# EAGLE design Breadboard_latest (EAGLE 6.4)
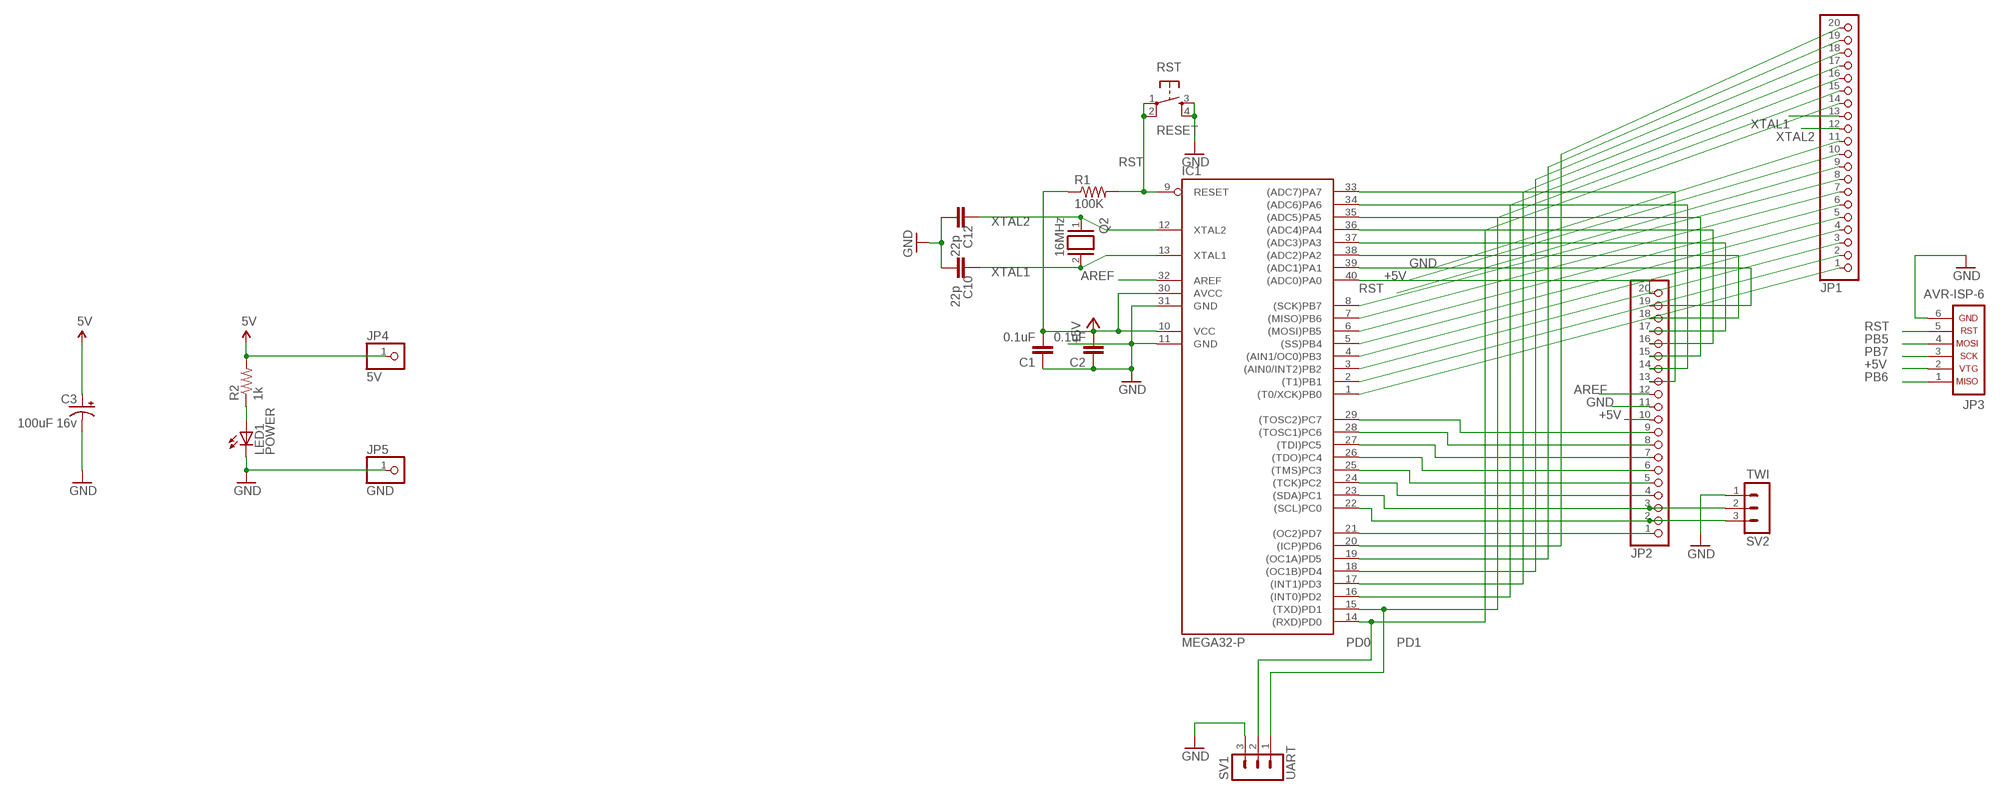
[diagram p0: schematic, sheet 1]

## Parts
C1  0.1uF  CAPPTH2  [CAP-PTH-SMALL2]
C2  0.1uF  CAPPTH2  [CAP-PTH-SMALL2]
C3  100uF 16v  CAP_POLPTH1  [CPOL-RADIAL-100UF-25V]
C10  22p  C-EU025-030X050  [C025-030X050]
C12  22p  C-EU025-030X050  [C025-030X050]
IC1  MEGA32-P  [DIL40]
JP1  PINHD-1X20  [1X20]
JP2  PINHD-1X20  [1X20]
JP3  AVR-ISP-6  [AVR-ISP-6]
JP4  5V  PINHD-1X1  [1X01]
JP5  GND  PINHD-1X1  [1X01]
LED1  POWER  LED3MM  [LED3MM]
Q2  16MHz  XTAL/S  [QS]
R1  100K  R-US_0207/10  [0207/10]
R2  1k  RESISTORPTH1  [AXIAL-0.3]
RST  RESET  TAC_SWITCHPTH  [TACTILE-PTH]
SV1  UART  MA03-1  [MA03-1]
SV2  TWI  MA03-1  [MA03-1]

## Nets
+5V: C1.2 C2.2 C3.1(+) IC1.10(VCC) IC1.30(AVCC) JP1.10 JP2.10 JP3.2 JP4.1 R1.1 R2.P$2 ; supply symbol labelled 5V
AREF: IC1.32(AREF) JP2.12
GND: C1.1 C2.1 C3.2(-) C10.1 C12.1 IC1.31(GND) JP1.11 JP2.11 JP3.6 JP5.1 LED1.K(C) RST.3 RST.4 SV1.3 SV2.1
LED1: LED1.A R2.P$1
N$1: IC1.1((T0/XCK)PB0) JP1.1
N$2: IC1.20((ICP)PD6) JP1.20
N$3: IC1.2((T1)PB1) JP1.2
N$4: IC1.3((AIN0/INT2)PB2) JP1.3
N$5: IC1.4((AIN1/OC0)PB3) JP1.4
N$6: IC1.5((SS)PB4) JP1.5
N$12: IC1.21((OC2)PD7) JP2.1
N$15: IC1.16((INT0)PD2) JP1.16
N$16: IC1.17((INT1)PD3) JP1.17
N$17: IC1.18((OC1B)PD4) JP1.18
N$18: IC1.19((OC1A)PD5) JP1.19
N$19: IC1.22((SCL)PC0) JP2.2 SV2.3
N$20: IC1.23((SDA)PC1) JP2.3 SV2.2
N$21: IC1.24((TCK)PC2) JP2.4
N$22: IC1.25((TMS)PC3) JP2.5
N$23: IC1.26((TDO)PC4) JP2.6
N$24: IC1.27((TDI)PC5) JP2.7
N$25: IC1.28((TOSC1)PC6) JP2.8
N$26: IC1.29((TOSC2)PC7) JP2.9
N$27: IC1.33((ADC7)PA7) JP2.13
N$28: IC1.34((ADC6)PA6) JP2.14
N$29: IC1.35((ADC5)PA5) JP2.15
N$30: IC1.36((ADC4)PA4) JP2.16
N$31: IC1.37((ADC3)PA3) JP2.17
N$32: IC1.38((ADC2)PA2) JP2.18
N$33: IC1.39((ADC1)PA1) JP2.19
N$34: IC1.40((ADC0)PA0) JP2.20
PB5: IC1.6((MOSI)PB5) JP1.6 JP3.4
PB6: IC1.7((MISO)PB6) JP1.7 JP3.1
PB7: IC1.8((SCK)PB7) JP1.8 JP3.3
PD0: IC1.14((RXD)PD0) JP1.14 SV1.2
PD1: IC1.15((TXD)PD1) JP1.15 SV1.1
RST: IC1.9(RESET) JP1.9 JP3.5 R1.2 RST.1 RST.2
XTAL1: C10.2 IC1.13(XTAL1) JP1.13 Q2.2
XTAL2: C12.2 IC1.12(XTAL2) JP1.12 Q2.1

## Power pins joined to a net without a drawn wire
GND: IC1.11(GND)

## Library data of the parts
C1 C2 = SparkFun:CAP: Capacitor Standard 0603 ceramic capacitor, and 0.1" leaded capacitor.
C3 = SparkFun:CAP_POL: Capacitor Polarized These are standard SMD and PTH capacitors. Normally 10uF, 47uF, and 100uF in electrolytic and tantalum varieties. Always verify the external diameter of the through hole cap, it varies with capacity, voltage, and manufacturer. The EIA devices should be standard.
C10 C12 = SmartPrj:C-EU: CAPACITOR, European symbol
IC1 = atmel:MEGA32-P: MICROCONTROLLER 32 Kbytes FLASH 2 Kbytes SRAM 1 Kbytes EEPROM USART 8-channel 10 bit ADC Source: www.atmel.com .. doc2503.pdf; MPN: ATMEGA32-16PU; OC_FARNELL: 1661729; OC_NEWARK: 51P1794
JP1 JP2 = pinhead:PINHD-1X20: PIN HEADER
JP3 = atmel:AVR-ISP-6: AVR ISP-6 Serial Programming Header
JP4 JP5 = pinhead:PINHD-1X1: PIN HEADER
LED1 = SparkFun:LED: LEDs Standard schematic elements and footprints for 5mm, 3mm, 1206, and 0603 sized LEDs. 5mm - Spark Fun Electronics SKU : COM-00529 (and others)
Q2 = special:XTAL/S: CRYSTAL
R1 = resistor:R-US_: RESISTOR, American symbol
R2 = SparkFun:RESISTOR: Resistor Basic schematic elements and footprints for 0603, 1206, and PTH 1/10th watt (small) resistors.
RST = SparkFun:TAC_SWITCH: Momentary Switch Button commonly used for reset or general input. Spark Fun Electronics SKU : COM-00097
SV1 SV2 = con-lstb:MA03-1: PIN HEADER; OC_FARNELL: unknown; OC_NEWARK: unknown

## Net classes
0 default: width 0.152 mm, drill 0.305 mm, clearance 0.152 mm

## Board
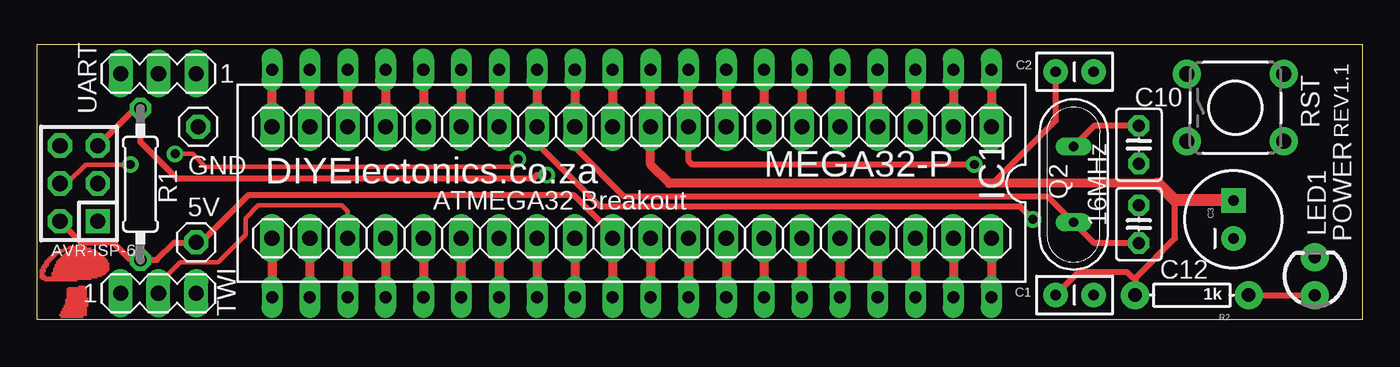
[diagram p1: board, top side]
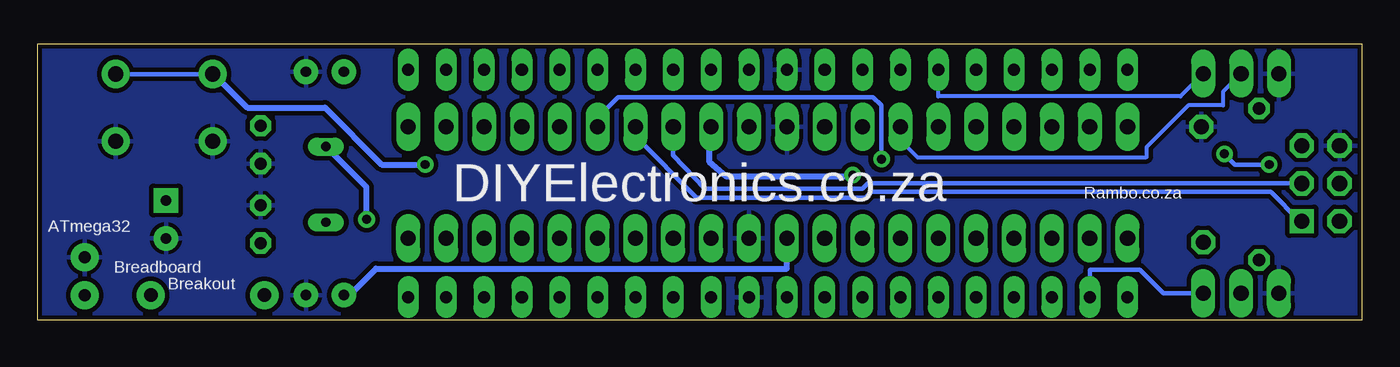
[diagram p2: board, bottom side, seen from below]

Size 88.9 x 18.48 mm. Coordinates in mm from the lower left corner, seen from the top.
Outline: 0,0 0,18.48 88.9,18.48 88.9,0 0,0
Copper layers (1*16): Top 0.035mm / dielectric 1.5mm / Bottom 0.035mm
Design rules "SparkFun": minimum track width 8mil, minimum drill 20mil, track to track 8mil, track to pad 8mil, pad to pad 8mil, via to via 8mil, smd to smd 8mil, copper to edge 10mil, drill to drill 8mil, minimum pad ring 12mil, minimum via ring 10mil, stop-mask expansion 4mil, vias tented up to drill 25mil, thermal gap 10mil

### Footprints (pad centres in the part's own frame; a part is rotated, then mirrored left to right if it is on the bottom)
CAP-PTH-SMALL2 = drill 0.7 pad 1.651: 1 0,0; 2 2.54,0
CPOL-RADIAL-100UF-25V = drill 0.7 pad 1.651 square: 1 1.27,0 | drill 0.7 pad 1.651: 2 -1.27,0
C025-030X050 = drill 0.813 octagon: 1 -1.27,0; 2 1.27,0
DIL40 = drill 0.813 long: 1 -24.13,-7.62; 2 -21.59,-7.62; 3 -19.05,-7.62; 4 -16.51,-7.62; 5 -13.97,-7.62; 6 -11.43,-7.62; 7 -8.89,-7.62; 8 -6.35,-7.62; 9 -3.81,-7.62; 10 -1.27,-7.62; 11 1.27,-7.62; 12 3.81,-7.62; 13 6.35,-7.62; 14 8.89,-7.62; 15 11.43,-7.62; 16 13.97,-7.62; 17 16.51,-7.62; 18 19.05,-7.62; 19 21.59,-7.62; 20 24.13,-7.62; 21 24.13,7.62; 22 21.59,7.62; 23 19.05,7.62; 24 16.51,7.62; 25 13.97,7.62; 26 11.43,7.62; 27 8.89,7.62; 28 6.35,7.62; 29 3.81,7.62; 30 1.27,7.62; 31 -1.27,7.62; 32 -3.81,7.62; 33 -6.35,7.62; 34 -8.89,7.62; 35 -11.43,7.62; 36 -13.97,7.62; 37 -16.51,7.62; 38 -19.05,7.62; 39 -21.59,7.62; 40 -24.13,7.62
1X20 = drill 1.016 long: 1 -24.13,0; 2 -21.59,0; 3 -19.05,0; 4 -16.51,0; 5 -13.97,0; 6 -11.43,0; 7 -8.89,0; 8 -6.35,0; 9 -3.81,0; 10 -1.27,0; 11 1.27,0; 12 3.81,0; 13 6.35,0; 14 8.89,0; 15 11.43,0; 16 13.97,0; 17 16.51,0; 18 19.05,0; 19 21.59,0; 20 24.13,0
AVR-ISP-6 = drill 1.016 square: 1 -2.54,-1.27 | drill 1.016 octagon: 2 -2.54,1.27; 3 0,-1.27; 4 0,1.27; 5 2.54,-1.27; 6 2.54,1.27
1X01 = drill 1.016 octagon: 1 0,0
LED3MM = drill 0.813 pad 1.88: A -1.27,0; K 1.27,0
QS = drill 0.61 long: 1 -2.54,0; 2 2.54,0
0207/10 = drill 0.813 octagon: 1 -5.08,0; 2 5.08,0
AXIAL-0.3 = drill 0.9 pad 1.88: P$1 -3.81,0; P$2 3.81,0
TACTILE-PTH = drill 1.016 pad 1.88: 1 -3.251,2.261; 2 3.251,2.261; 3 -3.251,-2.261; 4 3.251,-2.261
MA03-1 = drill 1.016 long: 1 -2.54,0; 2 0,0; 3 2.54,0

### Placement (x,y rotation side)
C1  70.87,1.65 180 top
C2  70.87,16.64 180 top
C3  80.26,6.73 90 top
C10  73.91,11.75 90 top
C12  73.91,6.41 270 top
IC1  39.88,9.14 180 top
JP1  39.88,12.95 180 top
JP2  39.88,5.46 0 top
JP3  2.79,9.14 90 top
JP4  10.67,5.21 0 top
JP5  10.79,12.95 0 top
LED1  85.72,2.92 90 top
Q2  69.53,9.08 90 top
R1  6.92,9.09 90 top
R2  77.47,1.65 180 top
RST  80.39,14.22 0 top
SV1  8.13,16.51 180 top
SV2  8.13,1.78 0 top

### Tracks (layer width: path | path; a pad name or v marks a point on that pad's centre or on a via)
+5V
  Top 0.406: C2.2 68.33,13.34 64.14,9.14 | 73.66,2.79 76.33,5.46 76.33,8 | 73.66,2.79 73.53,2.79 73.15,3.17 69.85,3.17 C1.2 | 73.66,2.79 R2.P$2 | JP3.2 2.95,5.18 5.08,5.18 6.2,4.06 R1.1 8.03,4.01 9.2,5.18 10.64,5.18 JP4.1 11,5.21 14.17,8.38 35.97,8.38 38.25,6.1 38.25,5.82 JP2.10
  Top 0.61: JP1.10 IC1.10 | 75.18,9.14 64.14,9.14 42.42,9.14 41.15,10.41 JP1.10 | 41.15,11.94 JP1.10 | JP2.10 IC1.30
  Top 0.813: C3.1 76.33,8 75.18,9.14
  Bottom 0.406: C1.2 67.94,1.65 66.17,3.43 38.61,3.43 JP2.10
AREF
  Top 0.61: JP2.12 IC1.32
GND
  Top 0.61: IC1.11 JP1.11 | JP2.11 IC1.31
  pour Bottom (isolate 0.305): 0,0 0,18.67 88.9,18.44 88.9,0
LED1
  Top 0.406: R2.P$1 LED1.A
N$1
  Top 0.61: IC1.1 JP1.1
N$2
  Top 0.61: JP1.20 IC1.20
N$3
  Top 0.61: IC1.2 JP1.2
N$4
  Top 0.61: IC1.3 JP1.3
N$5
  Top 0.61: IC1.4 JP1.4
N$6
  Top 0.61: IC1.5 JP1.5
N$12
  Top 0.61: JP2.1 IC1.21
N$15
  Top 0.61: IC1.16 JP1.16
N$16
  Top 0.61: IC1.17 JP1.17
N$17
  Top 0.61: IC1.18 JP1.18
N$18
  Top 0.61: IC1.19 JP1.19
N$19
  Top 0.61: JP2.2 IC1.22
  Bottom 0.305: SV2.3 13.36,1.78 14.94,3.35 18.24,3.35 18.29,3.3 IC1.22
N$20
  Top 0.305: SV2.2 8.13,2.39 9.6,3.86 12.14,3.86 13.97,5.69 13.97,6.81 14.83,7.67 20.42,7.67 20.83,7.26 JP2.3
  Top 0.61: JP2.3 IC1.23
N$21
  Top 0.61: JP2.4 IC1.24
N$22
  Top 0.61: JP2.5 IC1.25
N$23
  Top 0.61: JP2.6 IC1.26
N$24
  Top 0.61: JP2.7 IC1.27
N$25
  Top 0.61: JP2.8 IC1.28
N$26
  Top 0.61: JP2.9 IC1.29
N$27
  Top 0.61: JP2.13 IC1.33
N$28
  Top 0.61: JP2.14 IC1.34
N$29
  Top 0.61: JP2.15 IC1.35
N$30
  Top 0.61: JP2.16 IC1.36
N$31
  Top 0.61: JP2.17 IC1.37
N$32
  Top 0.61: JP2.18 IC1.38
N$33
  Top 0.61: JP2.19 IC1.39
N$34
  Top 0.61: JP2.20 IC1.40
PB5  (via drill 0.6)
  Top 0.305: v9.25,11.12 10.41,11.12 11.28,10.26 31.8,10.26 v32.26,10.77 | JP3.4 1.98,9.14 3.25,10.41 v6.25,10.41
  Top 0.61: IC1.6 JP1.6
  Bottom 0.305: v32.26,10.77 32.26,14.38 32.82,14.94 49.94,14.94 51.31,13.56 JP1.6 | v9.25,11.12 8.53,10.41 v6.25,10.41
PB6
  Top 0.61: IC1.7 JP1.7
  Bottom 0.305: JP3.1 4.06,6.66 4.22,6.66 6.15,8.59 32.92,8.59 33.33,8.18 44.65,8.18 48.77,12.29 JP1.7
PB7
  Top 0.61: IC1.8 JP1.8
  Bottom 0.305: JP3.3 33.17,9.14 33.53,8.79 44.09,8.79 46.23,11.02 JP1.8
PD0
  Top 0.61: IC1.14 JP1.14
  Bottom 0.254: SV1.2 9.35,15.29 9.35,14.38 11.68,14.38 14.48,11.58 14.48,10.92 14.53,10.87 29.82,10.87 30.99,12.04 JP1.14
PD1
  Top 0.61: IC1.15 JP1.15
  Bottom 0.254: SV1.1 12.19,14.99 28.45,14.99 IC1.15
RST  (via drill 0.6)
  Top 0.406: JP3.5 6.6,14.22 R1.2 6.92,11.93 9.4,9.45 33.27,9.45 33.53,9.7 v34.19,9.7 | v62.87,10.41 43.94,10.41 43.69,10.67 JP1.9 43.56,12.83
  Top 0.61: JP1.9 IC1.9
  Bottom 0.305: RST.2 RST.1
  Bottom 0.406: RST.1 77.06,16.48 74.8,14.22 69.6,14.22 65.79,10.41 v62.87,10.41 | JP1.9 43.79,12.85 43.79,10.57 42.67,9.6 34.54,9.6 34.44,9.7 v34.19,9.7
XTAL1  (via drill 0.6)
  Top 0.406: C10.2 70.93,13.02 Q2.2 | JP1.13 33.53,11.81 37.72,7.62 65.91,7.62 v66.8,6.73
  Top 0.61: IC1.13 JP1.13
  Bottom 0.406: v66.8,6.73 66.8,8.89 Q2.2
XTAL2
  Top 0.406: C12.2 70.93,5.14 Q2.1 67.82,8.26 39.37,8.26 36.07,11.56 JP1.12
  Top 0.61: IC1.12 JP1.12
(copper drawn outside any net)
  shapes: Top area x62

### Text on the board
tPlace: REV1.1 | DIYElectonics.co.za | ATMEGA32 Breakout
bPlace: Rambo.co.za | DIYElectronics.co.za | ATmega32 | Breadboard | Breakout